# EAGLE schematic main (EAGLE 7.4.0)
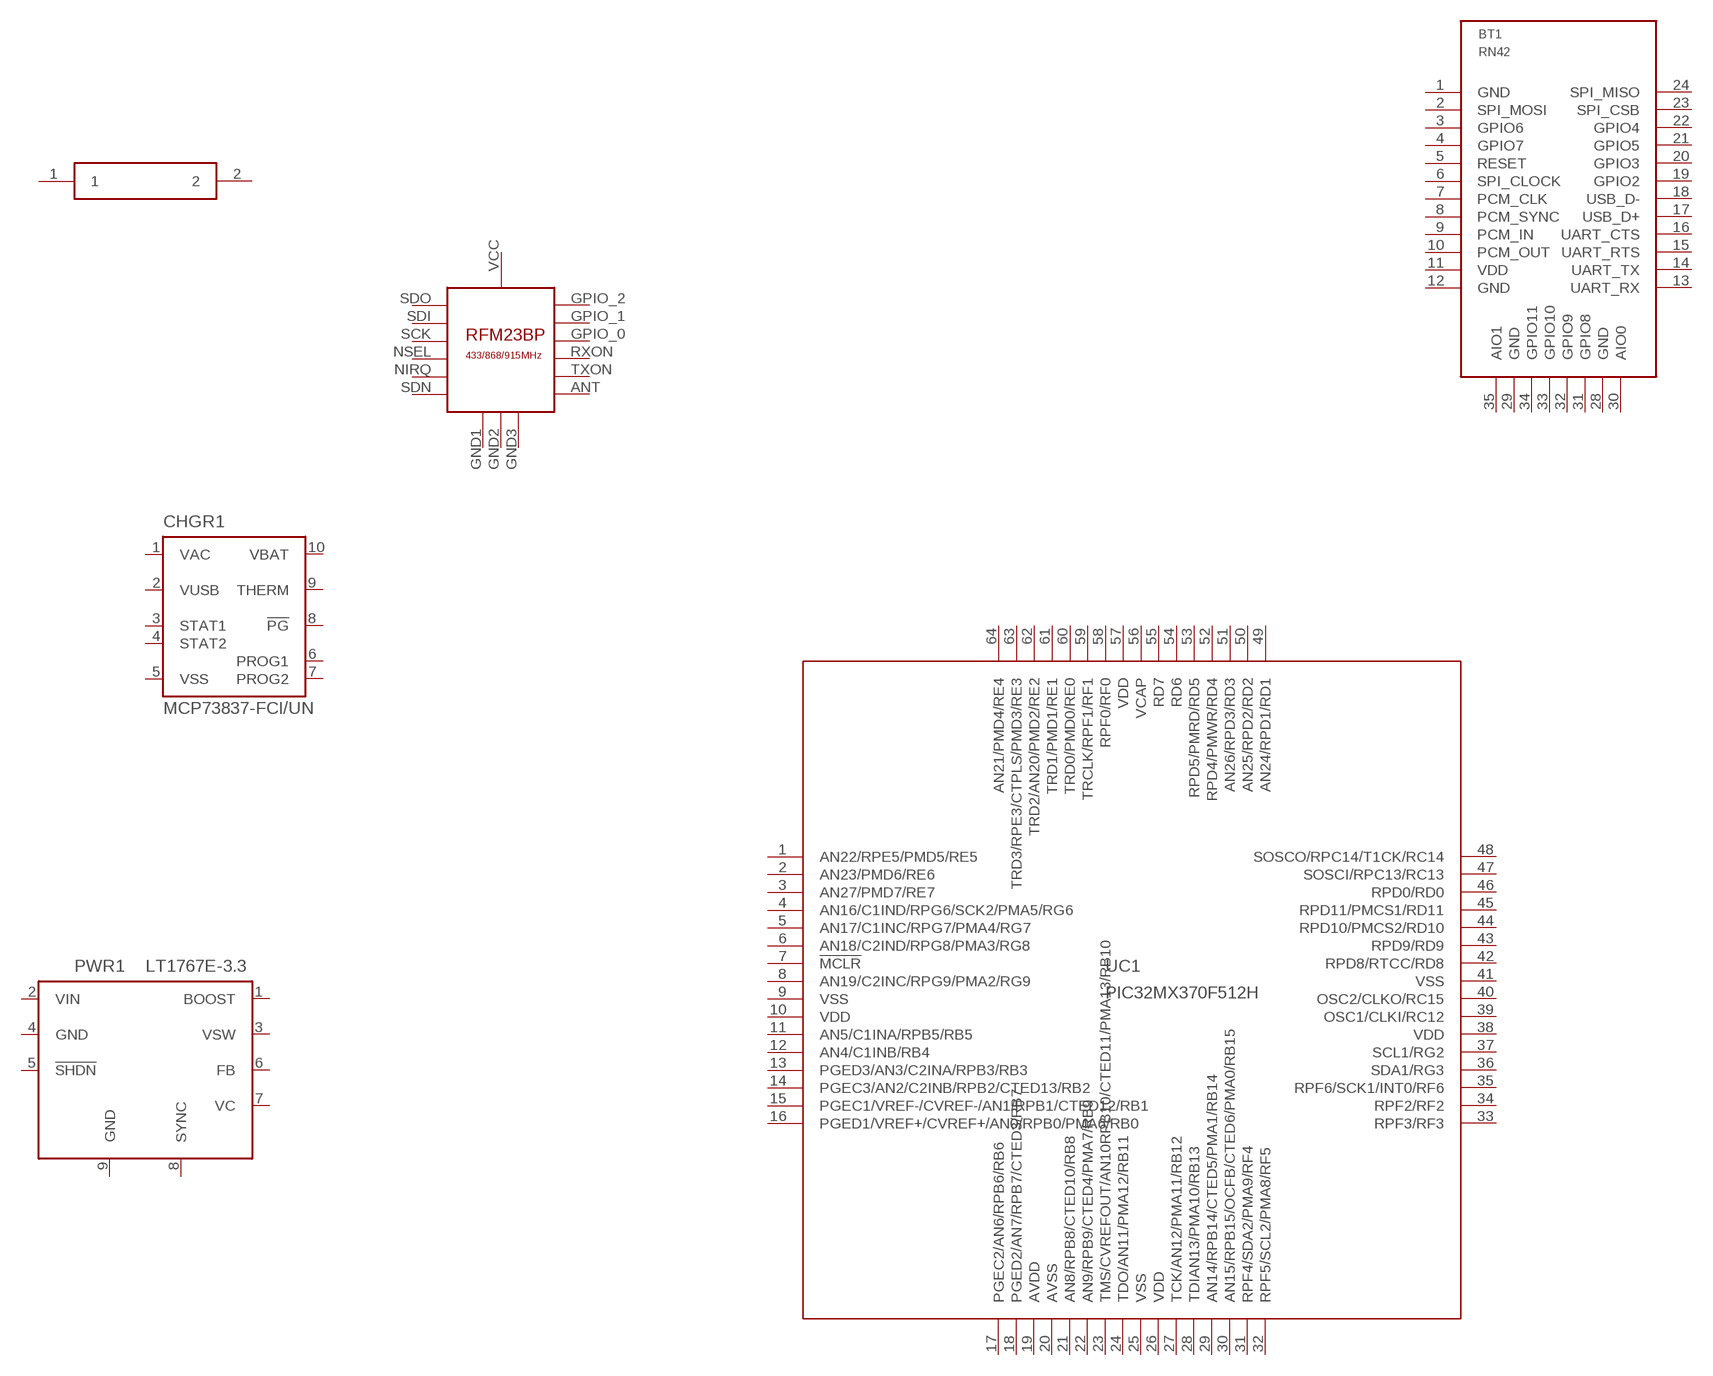
[diagram p0: schematic, sheet 1]

## Parts
ANT1  JOHANSON868  [JOHANSON868]
BT1  RN42  [RN42]
CHGR1  MCP73837-FCI/UN  [MSOP10]
PWR1  LT1767E-3.3  [MSOP8E]
U$1  RFM23BP  [RFM23BP]
UC1  PIC32MX370F512H  [TQFP64-10X10]
Unconnected: ANT1.1 ANT1.2 BT1.2(SPI_MOSI) BT1.3(GPIO6) BT1.4(GPIO7) BT1.5(RESET) BT1.6(SPI_CLOCK) BT1.7(PCM_CLK) BT1.8(PCM_SYNC) BT1.9(PCM_IN) BT1.10(PCM_OUT) BT1.13(UART_RX) BT1.14(UART_TX) BT1.15(UART_RTS) BT1.16(UART_CTS) BT1.17(USB_D+) BT1.18(USB_D-) BT1.19(GPIO2) BT1.20(GPIO3) BT1.21(GPIO5) BT1.22(GPIO4) BT1.23(SPI_CSB) BT1.24(SPI_MISO) BT1.30(AIO0) BT1.31(GPIO8) BT1.32(GPIO9) BT1.33(GPIO10) BT1.34(GPIO11) BT1.35(AIO1) CHGR1.3(STAT1) CHGR1.4(STAT2) CHGR1.6(PROG1) CHGR1.7(PROG2) CHGR1.8(!PG) CHGR1.9(THERM) PWR1.5(!SHDN) PWR1.6(FB) PWR1.7(VC) PWR1.8(SYNC) U$1.ANT U$1.GPIO_0 U$1.GPIO_1 U$1.GPIO_2 U$1.NIRQ U$1.NSEL U$1.RXON U$1.SCK U$1.SDI U$1.SDN U$1.SDO U$1.TXON UC1.1(AN22/RPE5/PMD5/RE5) UC1.2(AN23/PMD6/RE6) UC1.3(AN27/PMD7/RE7) UC1.4(AN16/C1IND/RPG6/SCK2/PMA5/RG6) UC1.5(AN17/C1INC/RPG7/PMA4/RG7) UC1.6(AN18/C2IND/RPG8/PMA3/RG8) UC1.7(!MCLR) UC1.8(AN19/C2INC/RPG9/PMA2/RG9) UC1.11(AN5/C1INA/RPB5/RB5) UC1.12(AN4/C1INB/RB4) UC1.13(PGED3/AN3/C2INA/RPB3/RB3) UC1.14(PGEC3/AN2/C2INB/RPB2/CTED13/RB2) UC1.15(PGEC1/VREF-/CVREF-/AN1/RPB1/CTED12/RB1) UC1.16(PGED1/VREF+/CVREF+/AN0/RPB0/PMA6/RB0) UC1.17(PGEC2/AN6/RPB6/RB6) UC1.18(PGED2/AN7/RPB7/CTED3/RB7) UC1.21(AN8/RPB8/CTED10/RB8) UC1.22(AN9/RPB9/CTED4/PMA7/RB9) UC1.23(TMS/CVREFOUT/AN10RPB10/CTED11/PMA13/RB10) UC1.24(TDO/AN11/PMA12/RB11) UC1.27(TCK/AN12/PMA11/RB12) UC1.28(TDIAN13/PMA10/RB13) UC1.29(AN14/RPB14/CTED5/PMA1/RB14) UC1.30(AN15/RPB15/OCFB/CTED6/PMA0/RB15) UC1.31(RPF4/SDA2/PMA9/RF4) UC1.32(RPF5/SCL2/PMA8/RF5) UC1.33(RPF3/RF3) UC1.34(RPF2/RF2) UC1.35(RPF6/SCK1/INT0/RF6) UC1.36(SDA1/RG3) UC1.37(SCL1/RG2) UC1.39(OSC1/CLKI/RC12) UC1.40(OSC2/CLKO/RC15) UC1.42(RPD8/RTCC/RD8) UC1.43(RPD9/RD9) UC1.44(RPD10/PMCS2/RD10) UC1.45(RPD11/PMCS1/RD11) UC1.46(RPD0/RD0) UC1.47(SOSCI/RPC13/RC13) UC1.48(SOSCO/RPC14/T1CK/RC14) UC1.49(AN24/RPD1/RD1) UC1.50(AN25/RPD2/RD2) UC1.51(AN26/RPD3/RD3) UC1.52(RPD4/PMWR/RD4) UC1.53(RPD5/PMRD/RD5) UC1.54(RD6) UC1.55(RD7) UC1.57(VDD) UC1.58(RPF0/RF0) UC1.59(TRCLK/RPF1/RF1) UC1.60(TRD0/PMD0/RE0) UC1.61(TRD1/PMD1/RE1) UC1.62(TRD2/AN20/PMD2/RE2) UC1.63(TRD3/RPE3/CTPLS/PMD3/RE3) UC1.64(AN21/PMD4/RE4)

## Power pins joined to a net without a drawn wire
AVDD: UC1.19(AVDD)
AVSS: UC1.20(AVSS)
BOOST: PWR1.1(BOOST)
GND: BT1.1(GND) BT1.12(GND) BT1.28(GND) BT1.29(GND) PWR1.4(GND) PWR1.9(GND)
GND1: U$1.GND1
GND2: U$1.GND2
GND3: U$1.GND3
VAC: CHGR1.1(VAC)
VBAT: CHGR1.10(VBAT)
VCAP: UC1.56(VCAP)
VCC: U$1.VCC
VDD: BT1.11(VDD) UC1.10(VDD) UC1.26(VDD) UC1.38(VDD)
VIN: PWR1.2(VIN)
VSS: CHGR1.5(VSS) UC1.9(VSS) UC1.25(VSS) UC1.41(VSS)
VSW: PWR1.3(VSW)
VUSB: CHGR1.2(VUSB)

## Library data of the parts
ANT1 = mylib1:JOHANSON868
BT1 = mylib1:RN42
CHGR1 = mylib1:MCP73837-FCI/UN
PWR1 = mylib1:LT1767E-3.3
U$1 = RFM23BP:RFM23BP: HopeRF RFM23BP Library by: http://projects.weber-itam.de
UC1 = mylib1:PIC32MX370F512H